# EAGLE schematic PCB (EAGLE 6.5.0)
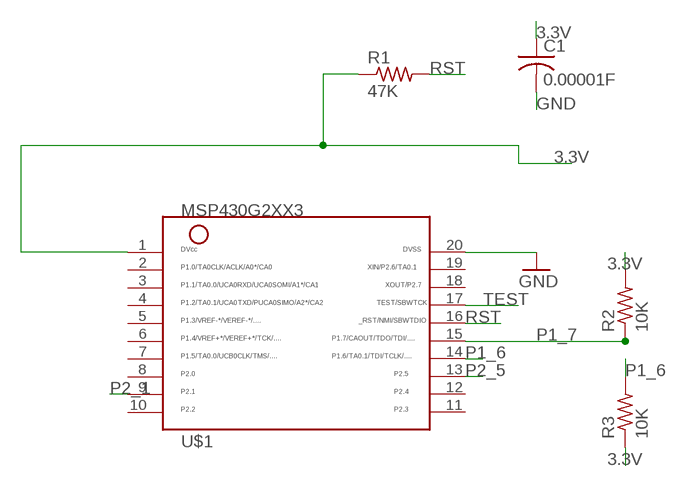
[diagram p0: schematic, sheet 1]

## Parts
C1  0.00001F  C-USC1206  [C1206]
R1  47K  R-US_R1206  [R1206]
R2  10K  R-US_R1206  [R1206]
R3  10K  R-US_R1206  [R1206]
U$1  MSP430G2XX3TSSOP  [PW20]

## Nets
3.3V: C1.1 R1.1 R2.2 R3.1 U$1.1
GND: C1.2 U$1.20
P1_6: R3.2 U$1.14
P1_7: R2.1 U$1.15
P2_1: U$1.9
P2_5: U$1.13
RST: R1.2 U$1.16
TEST: U$1.17
Unconnected: U$1.2 U$1.3 U$1.4 U$1.5 U$1.6 U$1.7 U$1.8 U$1.10 U$1.11 U$1.12 U$1.18 U$1.19

## Library data of the parts
C1 = resistor:C-US: CAPACITOR, American symbol
R1-R3 = resistor:R-US_: RESISTOR, American symbol
U$1 = ELEC327:MSP430G2XX3: MSP430G2XX3 PDIP (N) 20 Pin Package